# Altium schematic sheet alarm-interface.SchDoc
size A3; DocumentNumber: 2; SheetNumber: 2; SheetTotal: 5; SheetDescription: Alarm Interface
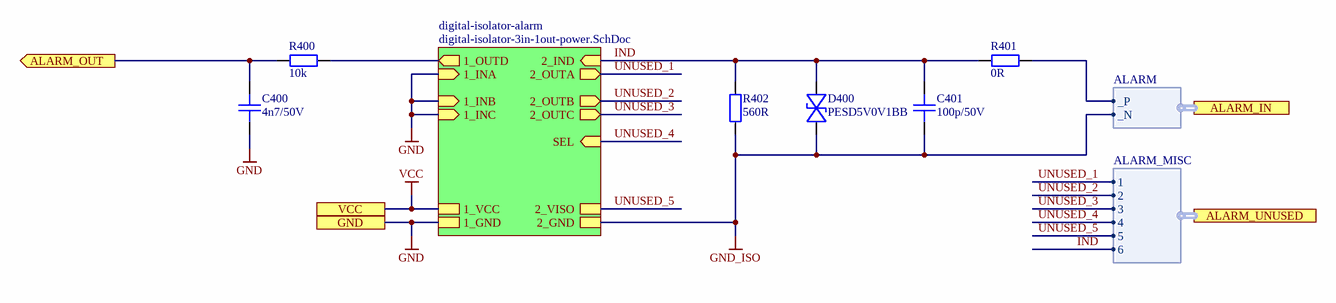
[diagram p0: alarm-interface.SchDoc]

## Parts
C400  4n7/50V  [CAPC1608X08N]
C401  100p/50V  [CAPC1608X08N]
D400  PESD5V0V1BB  [SOD523_PESD_NEXPERIA]
R400  10k  [RESC1608X05N]
R401  0R  [RESC1608X05N]
R402  560R  [RESC1608X05N]

## Sub-sheets
digital-isolator-alarm = digital-isolator-3in-1out-power.SchDoc: 2_OUTA (out), 1_VCC, 2_OUTB (out), 2_GND, 2_IND (in), 1_INA (in), 1_INB (in), 1_INC (in), 1_GND, 1_OUTD (out), 2_OUTC (out), 2_VISO, SEL (in)

## Ports
ALARM_IN (harness ALARM), ALARM_OUT (out), ALARM_UNUSED (harness ALARM_MISC), GND, VCC

## Harnesses
ALARM: _P, _N
ALARM_MISC: 1, 2, 3, 4, 5, 6

## Nets
GND: C400.1 ; port GND, sheet digital-isolator-alarm/1_INA, sheet digital-isolator-alarm/1_INB, sheet digital-isolator-alarm/1_INC, sheet digital-isolator-alarm/1_GND
GND_ISO: C401.1 D400.2(A) R402.2 ; sheet digital-isolator-alarm/2_GND, port ALARM_IN._N
VCC: port VCC, sheet digital-isolator-alarm/1_VCC
ALARM_OUT: C400.2 R400.2 ; port ALARM_OUT
IND: C401.2 D400.1(C) R401.1 R402.1 ; sheet digital-isolator-alarm/2_IND, port ALARM_UNUSED.6
UNUSED_1: sheet digital-isolator-alarm/2_OUTA, port ALARM_UNUSED.1
UNUSED_2: sheet digital-isolator-alarm/2_OUTB, port ALARM_UNUSED.2
UNUSED_3: sheet digital-isolator-alarm/2_OUTC, port ALARM_UNUSED.3
UNUSED_4: sheet digital-isolator-alarm/SEL, port ALARM_UNUSED.4
UNUSED_5: sheet digital-isolator-alarm/2_VISO, port ALARM_UNUSED.5
NetR400_1: R400.1 ; sheet digital-isolator-alarm/1_OUTD
NetR401_2: R401.2 ; port ALARM_IN._P

## Notes on the sheet
- Fraunhofer IISB
- Schottkystr. 10
- developed by:
- 91058 Erlangen
- Germany
- Author
- Project
- License
- Description
- File
- Version
- Release Date
- Sheet
- foxbms.org <https://foxbms.org>
- www.iisb.fraunhofer.de <https://www.iisb.fraunhofer.de/>
- foxBMS Team
- /

## Library data of the parts
C400 = gen_C_ceramic_4n7_50V_X7R_0603: MLCC; Capacitance: 4n7; Rated Voltage: 50V; Dielectric: X7R; Case EIA: 0603; Case Metric: 1608; PnP Package: 0603C; Automotive Qualified: True; Part Number: gen_C_ceramic_4n7_50V_X7R_0603; Supplier 1: Farnell; Supplier Part Number 1: 2904754
C401 = gen_C_ceramic_100p_50V_C0G_0603: MLCC; Capacitance: 100p; Rated Voltage: 50V; Dielectric: C0G; Tolerance: ± 10%; Case EIA: 0603; Case Metric: 1608; PnP Package: 0603C; PnP Value: 100pF/50V/NP0; PnP equipped: x; Automotive Qualified: True; AEC-Q Norm: AEC-Q200; Part Number: gen_C_ceramic_100p_50V_C0G_0603; Supplier 1: Farnell; Supplier Part Number 1: 2478236; ECCN: EAR99
D400 = PESD5V0V1BB: Very low capacitance bidirectional ESD protection diode; Manufacturer: Nexperia; Breakdown Voltage: 6.8V; PnP Package: SOD523; Automotive Qualified: True; AEC-Q Norm: AEC-Q101; Part Number: PESD5V0V1BB; Part Name: PESD5V0V1BB; Operating Temperature: -55°C - +150°C; Continuous Forward Current: *; ComponentLink1Description: Datasheet; ComponentLink1URL: https://assets.nexperia.com/documents/data-sheet/PESD5V0V1BB.pdf; Supplier 1: Mouser; Supplier Part Number 1: 771-PESD5V0V1BB115; Supplier 2: Digikey; Supplier Part Number 2: 1727-5808-1-ND; Supplier 3: Farnell; Supplier Part Number 3: 2069367; ECCN: EAR99
R400 = gen_R_10k_0603: SMD Resistor 10k 0603; Tolerance: 1%; Power: 0.1W; Case EIA: 0603; Case Metric: 1608; Maximum Working Voltage: 75V; PnP Package: 0603R; Automotive Qualified: True; PnP equipped: x; Part Number: gen_R_10k_0603; Operating Temperature: -55°C - +155°C; Resistance: 10k; Series: E24, E96; PnP Value: 10k; Supplier 1: Farnell; Supplier Part Number 1: 2073349
R401 = gen_R_0R_0603: SMD Resistor 0R 0603; Power: 0.1W; Case EIA: 0603; Case Metric: 1608; Maximum Working Voltage: 75V; PnP Package: 0603R; PnP equipped: x; Automotive Qualified: True; Part Number: gen_R_0R_0603; Operating Temperature: -55°C - +155°C; Resistance: 0R; Series: Jumper; PnP Value: 0R; Supplier 1: Farnell; Supplier Part Number 1: 2616580
R402 = gen_R_560R_0603: SMD Resistor 560R 0603; Tolerance: 1%; Power: 0.1W; Case EIA: 0603; Case Metric: 1608; Maximum Working Voltage: 75V; PnP Package: 0603R; Automotive Qualified: True; AEC-Q Grade: Grade 0; AEC-Q Norm: AEC-Q200; Part Number: gen_R_560R_0603; Operating Temperature: -55°C - +155°C; Resistance: 560R; Series: E24; PnP Value: 560R; ECCN: EAR99; Supplier 1: Mouser; Supplier Part Number 1: 667-ERJ-UP3F5600V